# Altium project dspic.PrjPCB
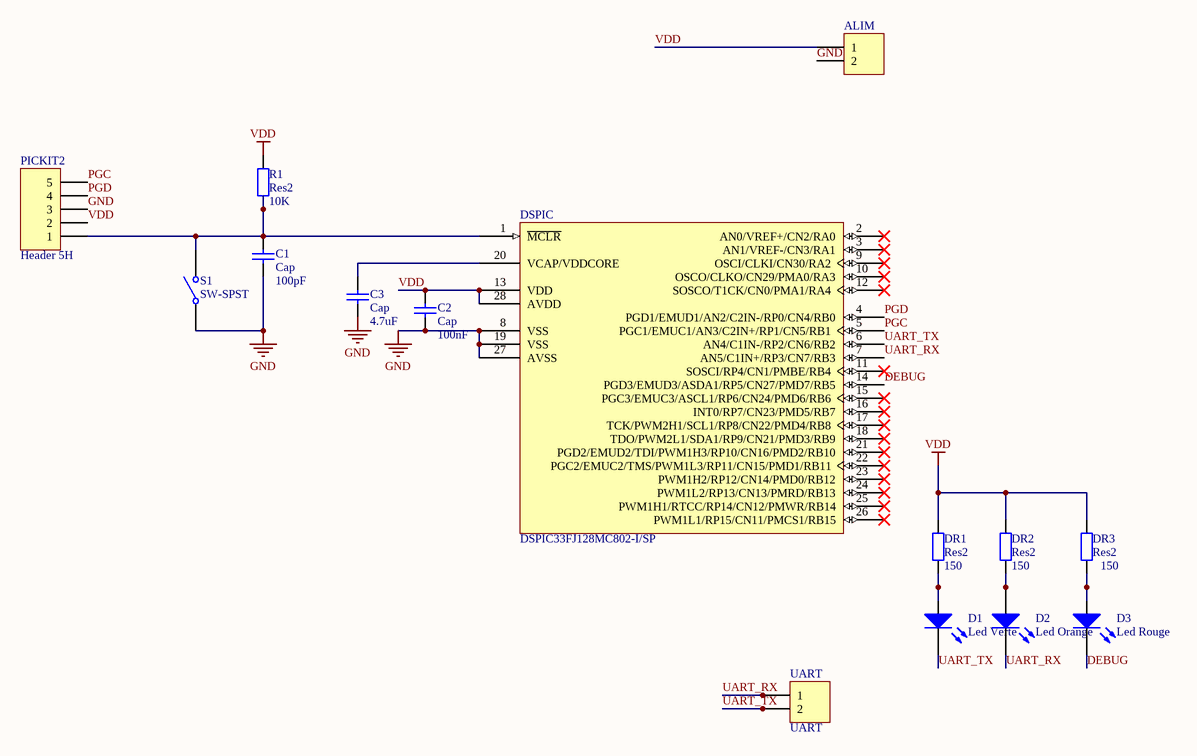
[diagram p0: Sheet1.SchDoc]
1 sheet, 15 parts. Net scope: global (net labels, ports and power ports of the same name join across sheets).

## Sheet Sheet1.SchDoc: DSPIC Cartograhpie
size A4

### Parts
ALIM  Bornier_2  [Bornier_2]  (value not drawn)
C1  Cap  value 100pF  [RAD-0.3]
C2  Cap  value 100nF  [RAD-0.3]
C3  Cap  value 4.7uF  [RAD-0.3]
D1  Led Verte  [LED]
D2  Led Orange  [LED]
D3  Led Rouge  [LED]
DR1  Res2  value 150  [AXIAL-0.4]
DR2  Res2  value 150  [AXIAL-0.4]
DR3  Res2  value 150  [AXIAL-0.4]
DSPIC  DSPIC33FJ128MC802-I/SP  [SPDIP300-SP28]
PICKIT2  Header 5H  [HDR1X5]
R1  Res2  value 10K  [AXIAL-0.4]
S1  SW-SPST  [SPST-2]
UART  UART  [Bornier_2]

### Nets
GND: ALIM.2 C1.1 C2.1 C3.1 DSPIC.8(VSS) DSPIC.19(VSS) DSPIC.27(AVSS) PICKIT2.3 S1.1(COMMON)
VDD: ALIM.1 C2.2 DR1.2 DR2.2 DR3.2 DSPIC.13(VDD) DSPIC.28(AVDD) PICKIT2.2 R1.2
DEBUG: D3.2(K) DSPIC.14(PGD3/EMUD3/ASDA1/RP5/CN27/PMD7/RB5)
PGC: DSPIC.5(PGC1/EMUC1/AN3/C2IN+/RP1/CN5/RB1) PICKIT2.5
PGD: DSPIC.4(PGD1/EMUD1/AN2/C2IN-/RP0/CN4/RB0) PICKIT2.4
UART_RX: D2.2(K) DSPIC.7(AN5/C1IN+/RP3/CN7/RB3) UART.1
UART_TX: D1.2(K) DSPIC.6(AN4/C1IN-/RP2/CN6/RB2) UART.2
NetC1_2: C1.2 DSPIC.1(~{MCLR}) PICKIT2.1 R1.1 S1.2(NO)
NetC3_2: C3.2 DSPIC.20(VCAP/VDDCORE)
NetD1_1: D1.1(A) DR1.1
NetD2_1: D2.1(A) DR2.1
NetD3_1: D3.1(A) DR3.1

Not connected (* = marked no-connect by the designer): DSPIC 2(AN0/VREF+/CN2/RA0)* 3(AN1/VREF-/CN3/RA1)* 9(OSCI/CLKI/CN30/RA2)* 10(OSCO/CLKO/CN29/PMA0/RA3)* 11(SOSCI/RP4/CN1/PMBE/RB4)* 12(SOSCO/T1CK/CN0/PMA1/RA4)* 15(PGC3/EMUC3/ASCL1/RP6/CN24/PMD6/RB6)* 16(INT0/RP7/CN23/PMD5/RB7)* 17(TCK/PWM2H1/SCL1/RP8/CN22/PMD4/RB8)* 18(TDO/PWM2L1/SDA1/RP9/CN21/PMD3/RB9)* 21(PGD2/EMUD2/TDI/PWM1H3/RP10/CN16/PMD2/RB10)* 22(PGC2/EMUC2/TMS/PWM1L3/RP11/CN15/PMD1/RB11)* 23(PWM1H2/RP12/CN14/PMD0/RB12)* 24(PWM1L2/RP13/CN13/PMRD/RB13)* 25(PWM1H1/RTCC/RP14/CN12/PMWR/RB14)* 26(PWM1L1/RP15/CN11/PMCS1/RB15)*

### Notes on the sheet
- Title :
- Size:
- A4
- Date:
- Time:
- File:

### Library data of the parts
ALIM UART = Bornier_2: Header, 2-Pin; LatestRevisionDate: 17-Jul-2002; LatestRevisionNote: Re-released for DXP Platform.; Publisher: Altium Limited
C1-C3 = Cap: Capacitor; Published: 8-Jun-2000; LatestRevisionDate: 17-Jul-2002; LatestRevisionNote: Re-released for DXP Platform.; PackageReference: RAD-0.3; Publisher: Altium Limited; PackageDescription: Radial Cap, Thru-Hole; 2 Leads; 0.3 in Pin Spacing
D1-D3 = Led: Published: 8-Jun-2000; LatestRevisionDate: 17-Jul-2002; LatestRevisionNote: Re-released for DXP Platform.; DatasheetDocument: 1998; PackageDocument: Aug-1999; PackageReference: DO-41; Publisher: Altium Limited; Code_JEDEC: DO-204-AL; ComponentLink1Description: Manufacturer Link; ComponentLink1URL: http://www.fairchildsemi.com/; ComponentLink2Description: Datasheet; ComponentLink2URL: http://www.fairchildsemi.com/ds/1N%2F1N4001.pdf
DR1-DR3 R1 = Res2: Resistor; Published: 8-Jun-2000; LatestRevisionDate: 17-Jul-2002; LatestRevisionNote: Re-released for DXP Platform.; PackageReference: AXIAL-0.4; Publisher: Altium Limited; PackageDescription: Axial Device, Thru-Hole; 2 Leads; 0.4 in Pin Spacing
DSPIC = DSPIC33FJ128MC802-I/SP: High-Performance 16-bit Digital Signal Controller, 128 KB Flash, 16 KB RAM, 28-Pin SPDIP, Industrial Temperature; Published: 29-Jan-2009; DatasheetVersion: revB, Mar-2008; PackageVersion: revAW, Oct-2008; PackageReference: SPDIP300-SP28; Publisher: Altium Limited; PackageDescription: 28-Lead Skinny Plastic Dual In-Line (SP) - 300 mil Body [SPDIP]; ComponentLink1Description: Manufacturer Link; ComponentLink1URL: http://www.microchip.com; ComponentLink2Description: Datasheet; ComponentLink2URL: http://ww1.microchip.com/downloads/en/DeviceDoc/70291B.pdf; ComponentLink3Description: Packaging Specification; ComponentLink3URL: http://ww1.microchip.com/downloads/en/PackagingSpec/00049AW.pdf
PICKIT2 = Header 5H: Header, 5-Pin, Right Angle; LatestRevisionDate: 17-Jul-2002; LatestRevisionNote: Re-released for DXP Platform.; Publisher: Altium Limited
S1 = SW-SPST: Single-Pole, Single-Throw Switch; Published: 24-Mar-1999; LatestRevisionDate: 17-Jul-2002; LatestRevisionNote: Re-released for DXP Platform.; PackageReference: SPST-2; Publisher: Altium Limited; PackageDescription: Switch; 2 Leads